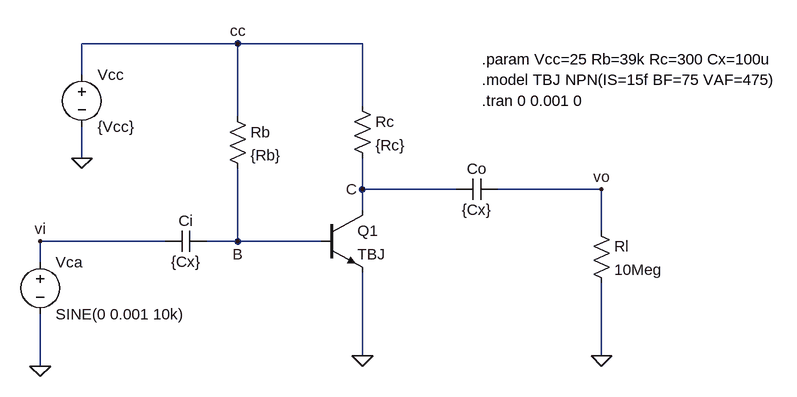
[diagram p0: schematic Q1.asc]
Q1.asc, the LTspice schematic file:
Version 4
SHEET 1 1236 680
WIRE 368 -208 128 -208
WIRE 560 -208 368 -208
WIRE 128 -160 128 -208
WIRE 560 -112 560 -208
WIRE 368 -96 368 -208
WIRE 128 -32 128 -80
WIRE 560 16 560 -32
WIRE 704 16 560 16
WIRE 928 16 768 16
WIRE 560 48 560 16
WIRE 928 80 928 16
WIRE 256 96 64 96
WIRE 368 96 368 -16
WIRE 368 96 320 96
WIRE 496 96 368 96
WIRE 64 128 64 96
WIRE 560 272 560 144
WIRE 928 272 928 160
WIRE 64 288 64 208
FLAG 64 288 0
FLAG 128 -32 0
FLAG 560 272 0
FLAG 928 272 0
FLAG 64 96 vi
FLAG 368 -208 cc
FLAG 368 96 B
FLAG 560 16 C
FLAG 928 16 vo
SYMBOL voltage 64 112 R0
WINDOW 123 0 0 Left 0
WINDOW 39 0 0 Left 0
SYMATTR InstName Vca
SYMATTR Value SINE(0 0.001 10k)
SYMBOL cap 320 80 R90
WINDOW 0 0 32 VBottom 2
WINDOW 3 32 32 VTop 2
SYMATTR InstName Ci
SYMATTR Value {Cx}
SYMBOL res 352 -112 R0
SYMATTR InstName Rb
SYMATTR Value {Rb}
SYMBOL voltage 128 -176 R0
SYMATTR InstName Vcc
SYMATTR Value {Vcc}
SYMBOL npn 496 48 R0
SYMATTR InstName Q1
SYMATTR Value TBJ
SYMBOL res 544 -128 R0
SYMATTR InstName Rc
SYMATTR Value {Rc}
SYMBOL cap 768 0 R90
WINDOW 0 0 32 VBottom 2
WINDOW 3 32 32 VTop 2
SYMATTR InstName Co
SYMATTR Value {Cx}
SYMBOL res 912 64 R0
SYMATTR InstName Rl
SYMATTR Value 10Meg
TEXT 744 -184 Left 2 !.param Vcc=25 Rb=39k Rc=300 Cx=100u\n.model TBJ NPN(IS=15f BF=75 VAF=475)
TEXT 744 -120 Left 2 !.tran 0 0.001 0

The netlist it stands for:
* Q1.asc
Vca vi 0 SINE(0 0.001 10k)
Ci B vi {Cx}
Rb cc B {Rb}
Vcc cc 0 {Vcc}
Q1 C B 0 0 TBJ
Rc cc C {Rc}
Co vo C {Cx}
Rl vo 0 10Meg
.model NPN NPN
.model PNP PNP
.lib standard.bjt
.param Vcc=25 Rb=39k Rc=300 Cx=100u
.model TBJ NPN(IS=15f BF=75 VAF=475)
.tran 0 0.001 0
.backanno
.end

* Results of the author's LTspice run, read from the files saved beside the schematic
* Operating Point, zero values left out:
*   V(b) = 744 mV
*   V(cc) = 25 V
*   V(c) = 10.71 V
*   Ic(Q1) = 47.63 mA
*   Ib(Q1) = 621.9 µA
*   Ie(Q1) = -48.25 mA
*   I(Rc) = 47.63 mA
*   I(Rb) = 621.9 µA
*   I(Vcc) = -48.25 mA
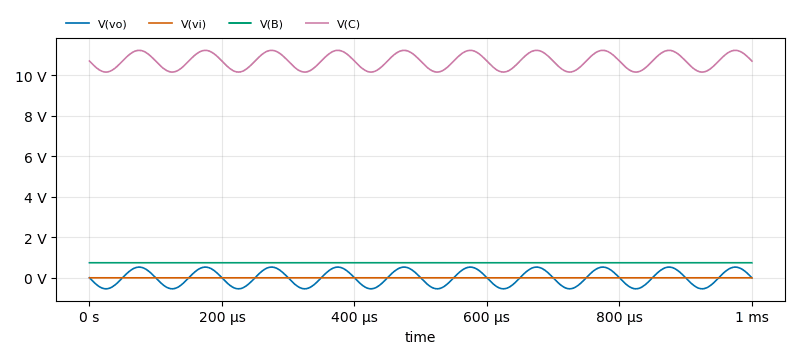
[diagram p1: Transient Analysis of Q1.asc, plotted from the saved traces]
* Transient Analysis, 1 run:
*   V(vo): min -543.7 mV, max 528.6 mV, average -2.485 mV, rms 379.1 mV, last 668.6 µV
*   V(vi): min -999.5 µV, max 999.8 µV, average -4.35 nV, rms 707.2 µV, last 0 V
*   V(B): min 743 mV, max 745 mV, average 744 mV, rms 744 mV, last 744 mV
*   V(C): min 10.17 V, max 11.24 V, average 10.71 V, rms 10.72 V, last 10.71 V